# Altium project SDR_PMR.PrjPcb (part 1 of 12)
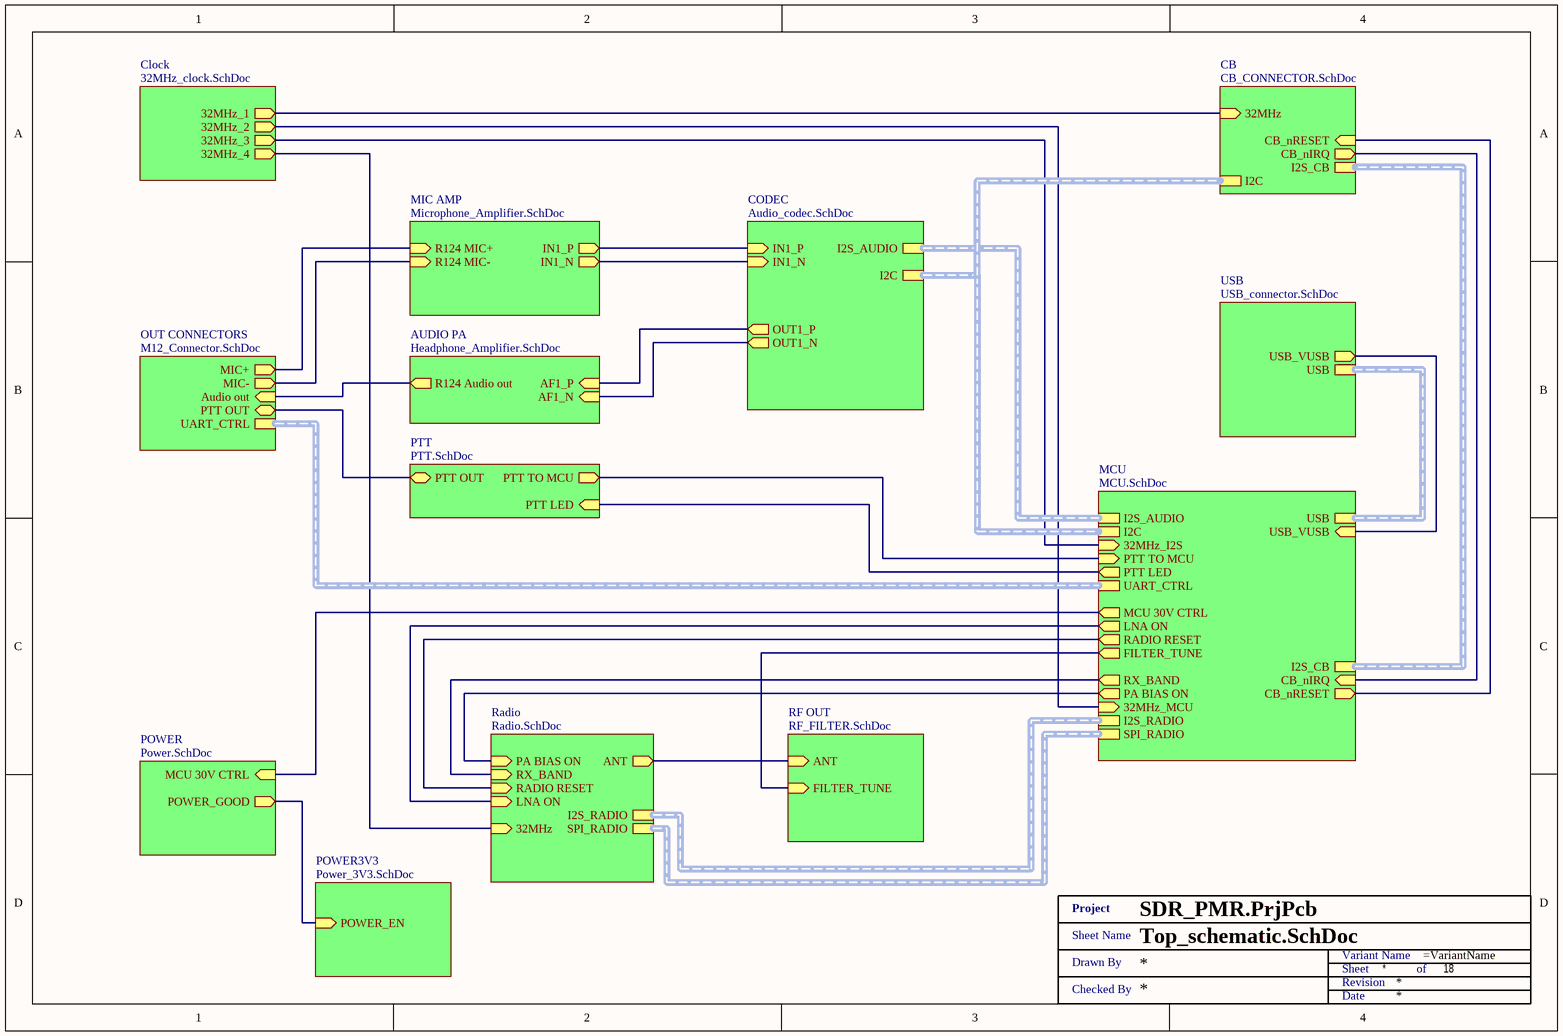
[diagram p0: Top_schematic.SchDoc]
18 sheets, 365 parts. Net scope: hierarchical (ports join the sheet entries above them; power ports are global).
Sheets:
  Top_schematic.SchDoc
    POWER = Power.SchDoc
    OUT CONNECTORS = M12_Connector.SchDoc
    MIC AMP = Microphone_Amplifier.SchDoc
    AUDIO PA = Headphone_Amplifier.SchDoc
    CODEC = Audio_codec.SchDoc
    Radio = Radio.SchDoc
      PA = Power_Amplifier.SchDoc
      FILTER1 = 70cm_BPF.SchDoc
      FILTER2 = 442MHz-450MHz_BPF.SchDoc
      LNA = LNA.SchDoc
    RF OUT = RF_FILTER.SchDoc
    MCU = MCU.SchDoc
    PTT = PTT.SchDoc
    USB = USB_connector.SchDoc
    POWER3V3 = Power_3V3.SchDoc
    CB = CB_CONNECTOR.SchDoc
    Clock = 32MHz_clock.SchDoc

## Sheet Top_schematic.SchDoc
size A4; SheetNumber: 1; SheetTotal: 18

### Parts
(Parts that share a designator on the sheet are numbered #1, #2 ... from top to bottom, then left to right.)
XX?#1  Title 1  (value not drawn)  (graphical)

### Sub-sheets
AUDIO PA = Headphone_Amplifier.SchDoc: R124 Audio out (out), AF1_P (in), AF1_N (in)
CB = CB_CONNECTOR.SchDoc: I2S_CB, CB_nIRQ (out), CB_nRESET (in), I2C, 32MHz (in)
Clock = 32MHz_clock.SchDoc: 32MHz_1 (out), 32MHz_2 (out), 32MHz_4 (out), 32MHz_3 (out)
CODEC = Audio_codec.SchDoc: I2S_AUDIO (harness I2S), IN1_P (in), IN1_N (in), OUT1_N (out), OUT1_P (out), I2C (harness I2C)
MCU = MCU.SchDoc: I2S_AUDIO, PTT TO MCU (in), PTT LED (out), UART_CTRL, SPI_RADIO, I2S_RADIO, 32MHz_MCU (in), PA BIAS ON (out), RX_BAND (out), FILTER_TUNE (out), RADIO RESET (out), USB (harness USB), USB_VUSB (in), MCU 30V CTRL (out), I2C, LNA ON (out), I2S_CB (harness I2S), CB_nIRQ (in), CB_nRESET (out), 32MHz_I2S (in)
MIC AMP = Microphone_Amplifier.SchDoc: R124 MIC+ (in), R124 MIC- (in), IN1_P (out), IN1_N (out)
OUT CONNECTORS = M12_Connector.SchDoc: MIC+ (out), MIC- (out), Audio out (in), PTT OUT (bidir), UART_CTRL (harness UART)
POWER = Power.SchDoc: POWER_GOOD (out), MCU 30V CTRL (in)
POWER3V3 = Power_3V3.SchDoc: POWER_EN (in)
PTT = PTT.SchDoc: PTT LED (in), PTT TO MCU (out), PTT OUT (bidir)
Radio = Radio.SchDoc: PA BIAS ON (in), ANT (out), I2S_RADIO (harness I2S), SPI_RADIO (harness SPI), RX_BAND (in), RADIO RESET (in), LNA ON (in), 32MHz (in)
RF OUT = RF_FILTER.SchDoc: ANT (in), FILTER_TUNE (in)
USB = USB_connector.SchDoc: USB, USB_VUSB (out)

### Nets
CB_nIRQ: sheet MCU/CB_nIRQ, sheet CB/CB_nIRQ
CB_nRESET: sheet MCU/CB_nRESET, sheet CB/CB_nRESET
LNA ON: sheet Radio/LNA ON, sheet MCU/LNA ON
MCU 30V CTRL: sheet POWER/MCU 30V CTRL, sheet MCU/MCU 30V CTRL
PG_5V: sheet POWER/POWER_GOOD, sheet POWER3V3/POWER_EN
RADIO RESET: sheet Radio/RADIO RESET, sheet MCU/RADIO RESET
USB_VUSB: sheet MCU/USB_VUSB, sheet USB/USB_VUSB
NetC4_1: sheet OUT CONNECTORS/MIC-, sheet MIC AMP/R124 MIC-
NetC4_2: sheet OUT CONNECTORS/MIC+, sheet MIC AMP/R124 MIC+
NetC63_2: sheet OUT CONNECTORS/Audio out, sheet AUDIO PA/R124 Audio out
NetD1_3: sheet MIC AMP/IN1_P, sheet CODEC/IN1_P
NetD2_3: sheet MIC AMP/IN1_N, sheet CODEC/IN1_N
NetJ16_10: sheet CB/32MHz, sheet Clock/32MHz_1
NetQ4_1: sheet Radio/RX_BAND, sheet MCU/RX_BAND
NetQ5_2: sheet MCU/PTT TO MCU, sheet PTT/PTT TO MCU
NetQ6_1: sheet MCU/PTT LED, sheet PTT/PTT LED
NetR50_1: sheet Radio/32MHz, sheet Clock/32MHz_4
NetR52_1: sheet Radio/PA BIAS ON, sheet MCU/PA BIAS ON
NetR54_1: sheet RF OUT/FILTER_TUNE, sheet MCU/FILTER_TUNE
NetR71_1: sheet AUDIO PA/AF1_N, sheet CODEC/OUT1_N
NetR77_1: sheet AUDIO PA/AF1_P, sheet CODEC/OUT1_P
NetR109_1: sheet OUT CONNECTORS/PTT OUT, sheet PTT/PTT OUT
NetR132_2: sheet MCU/32MHz_MCU, sheet Clock/32MHz_2
NetR134_2: sheet MCU/32MHz_I2S, sheet Clock/32MHz_3
NetU7_5: sheet Radio/ANT, sheet RF OUT/ANT

### Buses and harness runs
harness sheet CB/I2C = sheet CODEC/I2C = sheet MCU/I2C
harness sheet CB/I2S_CB = sheet MCU/I2S_CB
harness sheet CODEC/I2S_AUDIO = sheet MCU/I2S_AUDIO
harness sheet MCU/I2S_RADIO = sheet Radio/I2S_RADIO
harness sheet MCU/SPI_RADIO = sheet Radio/SPI_RADIO
harness sheet MCU/UART_CTRL = sheet OUT CONNECTORS/UART_CTRL
harness sheet MCU/USB = sheet USB/USB